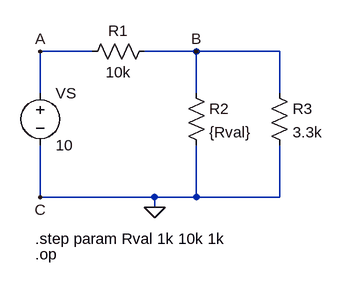
[diagram p0: schematic param_sweep.asc]
param_sweep.asc, the LTspice schematic file:
Version 4.1
SHEET 1 880 680
WIRE 80 0 0 0
WIRE 240 0 160 0
WIRE 368 0 240 0
WIRE 0 64 0 0
WIRE 240 64 240 0
WIRE 368 64 368 0
WIRE 0 224 0 144
WIRE 176 224 0 224
WIRE 240 224 240 144
WIRE 240 224 176 224
WIRE 368 224 368 144
WIRE 368 224 240 224
WIRE 176 240 176 224
FLAG 176 240 0
FLAG 240 0 B
FLAG 0 0 A
FLAG 0 224 C
SYMBOL res 64 16 R270
WINDOW 0 32 56 VTop 2
WINDOW 3 0 56 VBottom 2
SYMATTR InstName R1
SYMATTR Value 10k
SYMBOL res 224 48 R0
SYMATTR InstName R2
SYMATTR Value {Rval}
SYMBOL res 352 48 R0
SYMATTR InstName R3
SYMATTR Value 3.3k
SYMBOL voltage 0 48 R0
SYMATTR InstName VS
SYMATTR Value 10
TEXT -8 288 Left 2 !.step param Rval 1k 10k 1k
TEXT -8 312 Left 2 !.op

The netlist it stands for:
* param_sweep.asc
R1 A B 10k
R2 B 0 {Rval}
R3 B 0 3.3k
VS A 0 10
.step param Rval 1k 10k 1k
.op
.backanno
.end